# EAGLE schematic combined_pressure_sensor_rev2 (EAGLE 8.3.1)
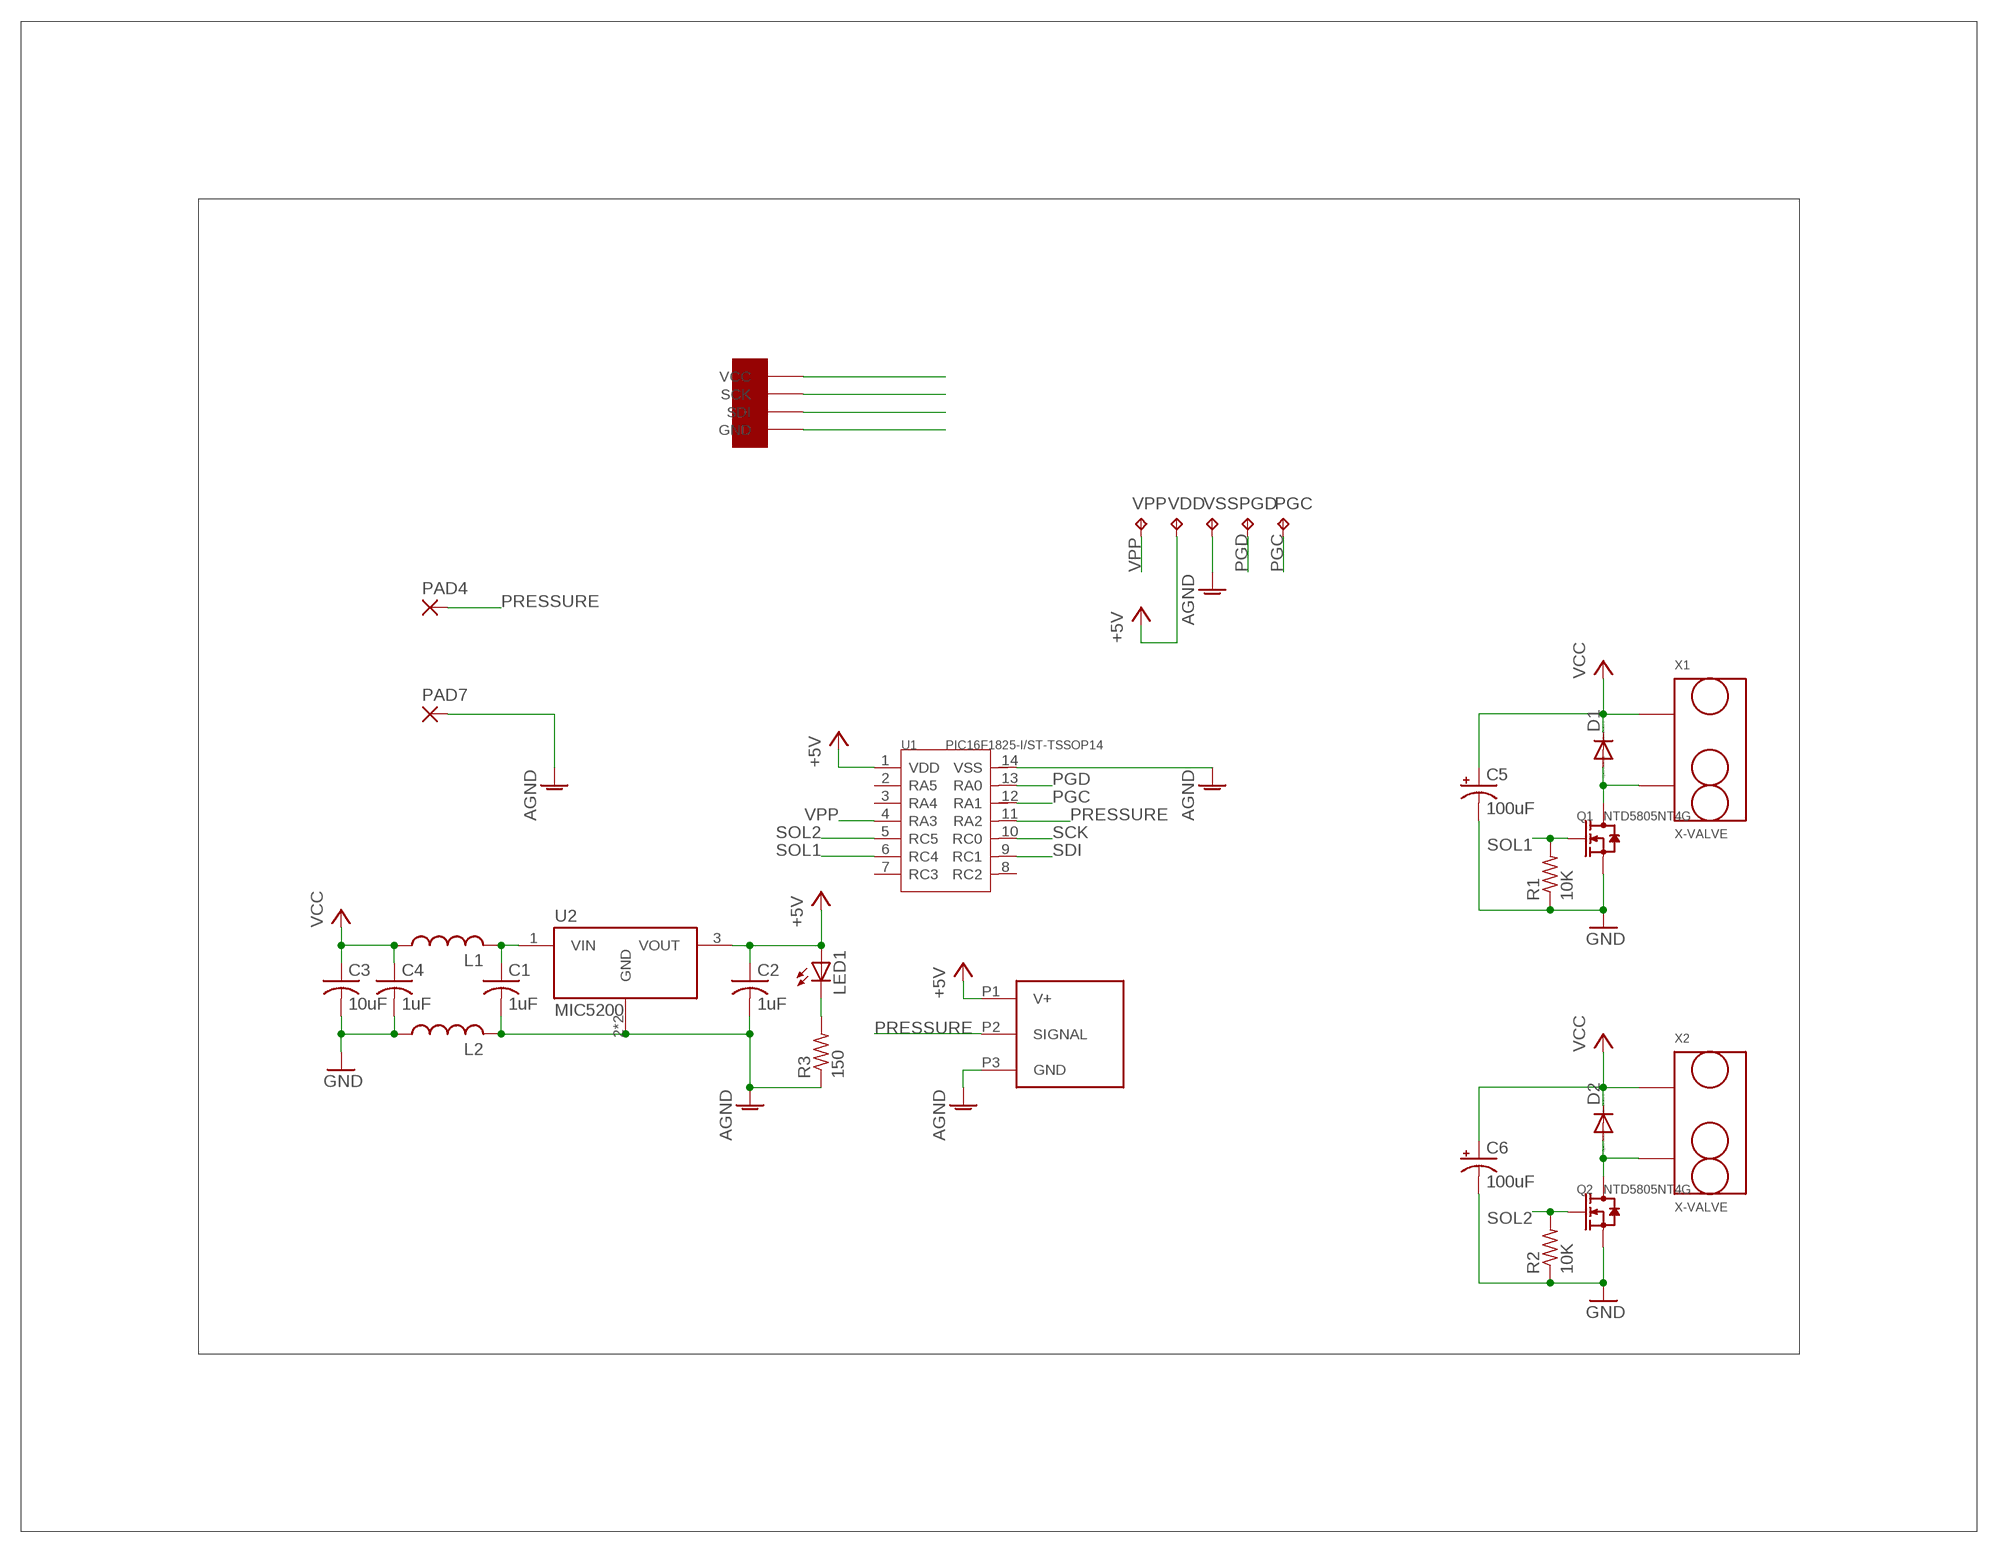
[diagram p0: schematic, sheet 1]

## Parts
C1  1uF  C-USC0603  [C0603]
C2  1uF  C-USC0603  [C0603]
C3  10uF  C-USC1206  [C1206]
C4  1uF  C-USC0603  [C0603]
C5  100uF  CPOL-US153CLV-0605  [153CLV-0605]
C6  100uF  CPOL-US153CLV-0605  [153CLV-0605]
D1  DIODE-SOD523  [SOD523]
D2  DIODE-SOD523  [SOD523]
L1  L-USL1206  [L1206]
L2  L-USL1206  [L1206]
LED1  LEDCHIP-LED0603  [CHIP-LED0603]
PAD4  SMD2  [SMD1,27-2,54]
PAD7  SMD2  [SMD1,27-2,54]
PGC  TPB1,27  [B1,27]
PGD  TPB1,27  [B1,27]
Q1  NTD5805NT4G  SMD-MOSFET-HIGH-POWER-N-CH-40V-51A-NTD5805NT4G(DPAK)  [DPAK]
Q2  NTD5805NT4G  SMD-MOSFET-HIGH-POWER-N-CH-40V-51A-NTD5805NT4G(DPAK)  [DPAK]
R1  10K  R-US_R0603  [R0603]
R2  10K  R-US_R0603  [R0603]
R3  150  R-US_R0603  [R0603]
U1  PIC16F1825-I/ST-TSSOP14  MCU-PIC16F1825-I/ST(TSSOP14)  [TSSOP14-0.65-5X4.4MM]
U2  MIC5200  [SOT223]
U$1  PICOBLADE4POS1.25MMRIGHTANGLESURFACE  [PICOBLADE4POSMALEHEADER]
U$3  ASDX  [ASDX]
VDD  TPB1,27  [B1,27]
VPP  TPB1,27  [B1,27]
VSS  TPB1,27  [B1,27]
X1  X-VALVE  [X-VALVE]
X2  X-VALVE  [X-VALVE]

## Nets
+5V: C2.1 LED1.A U1.1(VDD) U2.3(VOUT) U$3.P1(V+) VDD.TP
AGND: C1.2 C2.2 L2.2 PAD7.1(P) R3.1 U1.14(VSS) U2.2(GND) U2.4(GND) U$3.P3(GND) VSS.TP
GND: C3.2 C4.2 C5.- C6.- L2.1 Q1.2(S) Q2.2(S) R1.1 R2.1 U$1.GND
N$1: D1.A Q1.3(D) X1.P$2
N$2: D2.A Q2.3(D) X2.P$2
N$3: C1.1 L1.2 U2.1(VIN)
N$6: LED1.C R3.2
PGC: PGC.TP U1.12(RA1)
PGD: PGD.TP U1.13(RA0)
PRESSURE: PAD4.1(P) U1.11(RA2) U$3.P2(SIGNAL)
SCK: U1.10(RC0) U$1.SCK
SDI: U1.9(RC1) U$1.SDI
SOL1: Q1.1(G) R1.2 U1.6(RC4)
SOL2: Q2.1(G) R2.2 U1.5(RC5)
VCC: C3.1 C4.1 C5.+ C6.+ D1.C D2.C L1.1 U$1.VCC X1.P$1 X2.P$1
VPP: U1.4(RA3) VPP.TP
Unconnected: U1.2(RA5) U1.3(RA4) U1.7(RC3) U1.8(RC2)

## Library data of the parts
C1-C4 = rcl:C-US: CAPACITOR, American symbol
C5 C6 = rcl:CPOL-US: POLARIZED CAPACITOR, American symbol
D1 D2 = diode:DIODE-: DIODE
L1 L2 = rcl:L-US: INDUCTOR, American symbol
LED1 = led:LED: LED OSRAM: - CHIPLED LG R971, LG N971, LY N971, LG Q971, LY Q971, LO R971, LY R971 LH N974, LH R974 LS Q976, LO Q976, LY Q976 LO Q996 - Hyper CHIPLED LW Q18S LB Q993, LB Q99A, LB R99A - SideLED LS A670, LO A670, LY A670, LG A670, LP A670 LB A673, LV A673, LT A673, LW A673 LH A674 LY A675 LS A676, LA A676, LO A676, LY A676, LW A676 LS A679, LY A679, LG A679 - Hyper Micro SIDELED® LS Y876, LA Y876, LO Y876, LY Y876 LT Y87S - SmartLED LW L88C, LW L88S LB L89C, LB L89S, LG L890 LS L89K, LO L89K, LY L89K LS L896, LA L896, LO L896, LY L896 - TOPLED LS T670, LO T670, LY T670, LG T670, LP T670 LSG T670, LSP T670, LSY T670, LOP T670, LYG T670 LG T671, LOG T671, LSG T671 LB T673, LV T673, LT T673, LW T673 LH T674 LS T676, LA T676, LO T676, LY T676, LB T676, LH T676, LSB T676, LW T676 LB T67C, LV T67C, LT T67C, LS T67K, LO T67K, LY T67K, LW E67C LS E67B, LA E67B, LO E67B, LY E67B, LB E67C, LV E67C, LT E67C LW T67C LS T679, LY T679, LG T679 LS T770, LO T770, LY T770, LG T770, LP T770 LB T773, LV T773, LT T773, LW T773 LH T774 LS E675, LA E675, LY E675, LS T675 LS T776, LA T776, LO T776, LY T776, LB T776 LHGB T686 LT T68C, LB T68C - Hyper Mini TOPLED® LB M676 - Mini TOPLED Santana® LG M470 LS M47K, LO M47K, LY M47K Source: http://www.osram.convergy.de LUXEON: - LUMILED® LXK2-PW12-R00, LXK2-PW12-S00, LXK2-PW14-U00, LXK2-PW14-V00 LXK2-PM12-R00, LXK2-PM12-S00, LXK2-PM14-U00 LXK2-PE12-Q00, LXK2-PE12-R00, LXK2-PE12-S00, LXK2-PE14-T00, LXK2-PE14-U00 LXK2-PB12-K00, LXK2-PB12-L00, LXK2-PB12-M00, LXK2-PB14-N00, LXK2-PB14-P00, LXK2-PB14-Q00 LXK2-PR12-L00, LXK2-PR12-M00, LXK2-PR14-Q00, LXK2-PR14-R00 LXK2-PD12-Q00, LXK2-PD12-R00, LXK2-PD12-S00 LXK2-PH12-R00, LXK2-PH12-S00 LXK2-PL12-P00, LXK2-PL12-Q00, LXK2-PL12-R00 Source: www.luxeon.com KINGBRIGHT: KA-3528ASYC Source: www.kingbright.com
PAD4 PAD7 = wirepad:SMD2: SMD PAD
PGC PGD VDD VPP VSS = testpad:TP: Test pad
Q1 Q2 = Seeed-OPL-Transistor:SMD-MOSFET-HIGH-POWER-N-CH-40V-51A-NTD5805NT4G(DPAK): 305030078; MPN: NTD5805NT4G
R1-R3 = rcl:R-US_: RESISTOR, American symbol
U1 = Seeed-OPL-ic:MCU-PIC16F1825-I/ST(TSSOP14): 310010120; MPN: PIC16F1825-I/ST
U2 = microchip:MIC5200: 100 mA Low-Dropout Regulator Features • High Output Voltage Accuracy • Variety of Output Voltages • Guaranteed 100 mA Output • Low Quiescent Current • Low Dropout Voltage • Extremely Tight Load and Line Regulation • Very Low Temperature Coefficient • Current and Thermal Limiting • Zero OFF Mode Current • Logic-Controlled Electronic Shutdown • Available in 8-Lead SOIC, MM8 8-Lead MSOP, and SOT-223 Packages
U$1 = MolexConnector:PICOBLADE4POS1.25MMRIGHTANGLESURFACE
U$3 = honeywell_pressure_sensors:ASDX
X1 X2 = parker-valve:X-VALVE